# Altium schematic sheet 飞控.SchDoc
size A4
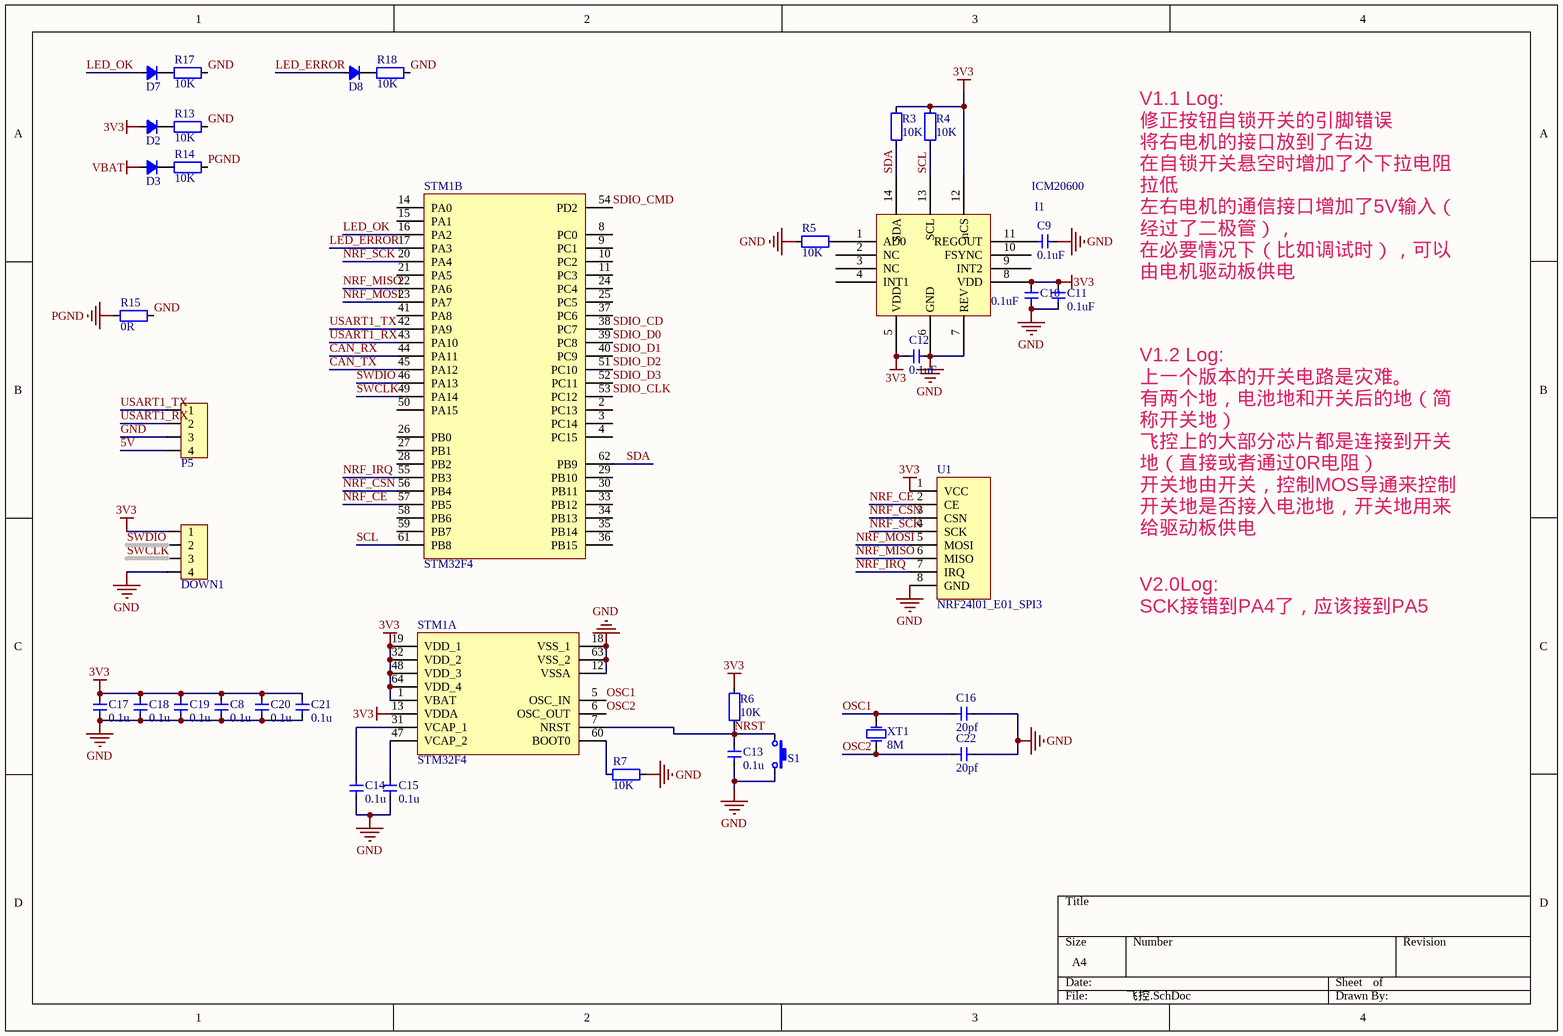
[diagram p0: 飞控.SchDoc]

## Parts
C8  value 0.1u  [CAP_0603]  (hidden comment: Cap_0603)
C9  value 0.1uF  [CAP_0603]  (hidden comment: Cap_0603)
C10  value 0.1uF  [CAP_0603]  (hidden comment: Cap_0603)
C11  value 0.1uF  [CAP_0603]  (hidden comment: Cap_0603)
C12  value 0.1uF  [CAP_0603]  (hidden comment: Cap_0603)
C13  value 0.1u  [CAP_0603]  (hidden comment: Cap_0603)
C14  value 0.1u  [CAP_0603]  (hidden comment: Cap_0603)
C15  value 0.1u  [CAP_0603]  (hidden comment: Cap_0603)
C16  value 20pf  [CAP_0603]  (hidden comment: Cap_0603)
C17  value 0.1u  [CAP_0603]  (hidden comment: Cap_0603)
C18  value 0.1u  [CAP_0603]  (hidden comment: Cap_0603)
C19  value 0.1u  [CAP_0603]  (hidden comment: Cap_0603)
C20  value 0.1u  [CAP_0603]  (hidden comment: Cap_0603)
C21  value 0.1u  [CAP_0603]  (hidden comment: Cap_0603)
C22  value 20pf  [CAP_0603]  (hidden comment: Cap_0603)
D2  D_0805  [LED_0805_YELLOW]  (value not drawn)
D3  D_0805  [LED_0805_YELLOW]  (value not drawn)
D7  D_0805  [LED_0805_YELLOW]  (value not drawn)
D8  D_0805  [LED_0805_YELLOW]  (value not drawn)
DOWN1  HDR1x4_2.54  [HDR1x4_2.54_180]  (value not drawn)
I1  ICM20600  [ICM20600]
P5  HDR1x4_2.54  [HDR1x4_2.54_180]  (value not drawn)
R3  value 10K  [RES_0603]  (hidden comment: Res_0603)
R4  value 10K  [RES_0603]  (hidden comment: Res_0603)
R5  value 10K  [RES_0603]  (hidden comment: Res_0603)
R6  value 10K  [RES_0603]  (hidden comment: Res_0603)
R7  value 10K  [RES_0603]  (hidden comment: Res_0603)
R13  value 10K  [RES_0603]  (hidden comment: Res_0603)
R14  value 10K  [RES_0603]  (hidden comment: Res_0603)
R15  value 0R  [RES_0603]  (hidden comment: Res_0603)
R17  value 10K  [RES_0603]  (hidden comment: Res_0603)
R18  value 10K  [RES_0603]  (hidden comment: Res_0603)
S1  ButtonTACT_3x4x2_180  [ButtonTACT_3x4x2_180H]  (value not drawn)
STM1  STM32F4  [LQFP_P0.5_64]  (parts A,B of 2)
U1  NRF24l01_E01_SPI3  [E01-ML01SP2]
XT1  value 8M  [XT_5032_2]  (hidden comment: XTAL_5032_2P)

## Nets
3V3: C8.2 C10.1 C11.1 C12.2 C17.2 C18.2 C19.2 C20.2 C21.2 D2.1(A) DOWN1.1 I1.5(VDD) I1.8(VDD) I1.12(nCS) R3.1 R4.1 R6.1 STM1.1(VBAT) STM1.13(VDDA) STM1.19(VDD_1) STM1.32(VDD_2) STM1.48(VDD_3) STM1.64(VDD_4) U1.1(VCC)
GND: C8.1 C9.2 C10.2 C11.2 C12.1 C13.1 C14.2 C15.2 C16.1 C17.1 C18.1 C19.1 C20.1 C21.1 C22.1 DOWN1.4 I1.6(GND) I1.7(REV) P5.3 R5.1 R7.2 R13.2 R15.2 R17.2 R18.2 S1.2 STM1.12(VSSA) STM1.18(VSS_1) STM1.63(VSS_2) U1.8(GND)
PGND: R14.2 R15.1
VBAT: D3.1(A)
5V: P5.4
CAN_RX: STM1.44(PA11)
CAN_TX: STM1.45(PA12)
LED_ERROR: D8.1(A) STM1.17(PA3)
LED_OK: D7.1(A) STM1.16(PA2)
NRF_CE: STM1.57(PB5) U1.2(CE)
NRF_CSN: STM1.56(PB4) U1.3(CSN)
NRF_IRQ: STM1.55(PB3) U1.7(IRQ)
NRF_MISO: STM1.22(PA6) U1.6(MISO)
NRF_MOSI: STM1.23(PA7) U1.5(MOSI)
NRF_SCK: STM1.20(PA4) U1.4(SCK)
NRST: C13.2 R6.2 S1.1 STM1.7(NRST)
OSC1: C16.2 STM1.5(OSC_IN) XT1.2(OSC2)
OSC2: C22.2 STM1.6(OSC_OUT) XT1.1(OSC1)
SCL: I1.13(SCL) R4.2 STM1.61(PB8)
SDA: I1.14(SDA) R3.2 STM1.62(PB9)
SDIO_CD: STM1.38(PC7)
SDIO_CLK: STM1.53(PC12)
SDIO_CMD: STM1.54(PD2)
SDIO_D0: STM1.39(PC8)
SDIO_D1: STM1.40(PC9)
SDIO_D2: STM1.51(PC10)
SDIO_D3: STM1.52(PC11)
SWCLK: DOWN1.3 STM1.49(PA14)
SWDIO: DOWN1.2 STM1.46(PA13)
USART1_RX: P5.2 STM1.43(PA10)
USART1_TX: P5.1 STM1.42(PA9)
NetC9_1: C9.1 I1.11(REGOUT)
NetC14_1: C14.1 STM1.31(VCAP_1)
NetC15_1: C15.1 STM1.47(VCAP_2)
NetD2_2: D2.2(K) R13.1
NetD3_2: D3.2(K) R14.1
NetD7_2: D7.2(K) R17.1
NetD8_2: D8.2(K) R18.1
NetI1_1: I1.1(AD0) R5.2
NetR7_1: R7.1 STM1.60(BOOT0)

Not connected (* = marked no-connect by the designer): I1 2(NC) 3(NC) 4(INT1) 9(INT2) 10(FSYNC); STM1 2(PC13) 3(PC14) 4(PC15) 8(PC0) 9(PC1) 10(PC2) 11(PC3) 14(PA0) 15(PA1) 21(PA5) 24(PC4) 25(PC5) 26(PB0) 27(PB1) 28(PB2) 29(PB10) 30(PB11) 33(PB12) 34(PB13) 35(PB14) 36(PB15) 37(PC6) 41(PA8) 50(PA15) 58(PB6) 59(PB7)

## Notes on the sheet
- V1.1 Log:
  修正按钮自锁开关的引脚错误
  将右电机的接口放到了右边
  在自锁开关悬空时增加了个下拉电阻拉低
  左右电机的通信接口增加了5V输入（经过了二极管），
  在必要情况下（比如调试时），可以由电机驱动板供电
- V1.2 Log:
  上一个版本的开关电路是灾难。
  有两个地，电池地和开关后的地（简称开关地）
  飞控上的大部分芯片都是连接到开关地（直接或者通过0R电阻）
  开关地由开关，控制MOS导通来控制开关地是否接入电池地，开关地用来给驱动板供电
  而飞控和驱动板之间通过SCK,CSN,MO,MI,G，连接在一起。这里的G是飞控的开关地。
  由于SCK这些引脚内部是连到单片机中的，实际上相当于这些引脚经过一个二极管反向
  练到单片机地（即电池地），因此将飞控和驱动板连接后，即使开关没有作用，电池地和
  开关地也会几乎连在一起。几乎的意思是说是由两边单片机的二级管导致的等效连在一起。
  而一旦打开开关，开关地会连到电池地上，导致电压有个突变，这个突变就容易将单片机烧了。
  实测烧了3片f405
- V2.0Log:
  SCK接错到PA4了，应该接到PA5

## Library data of the parts
C8-C22 = Cap_0603: Capacitor
DOWN1 P5 = HDR1x4_2.54: Header
R3-R7 R13-R15 R17 R18 = Res_0603: Resistor
S1 = ButtonTACT_3x4x2_180: Button
STM1 = STM32F405R: MCU
U1 = NRF24l01_E01_SPI2
XT1 = XTAL_5032_2P: Crystal Oscillator